# EAGLE design DataBoard (EAGLE 9.6.2)
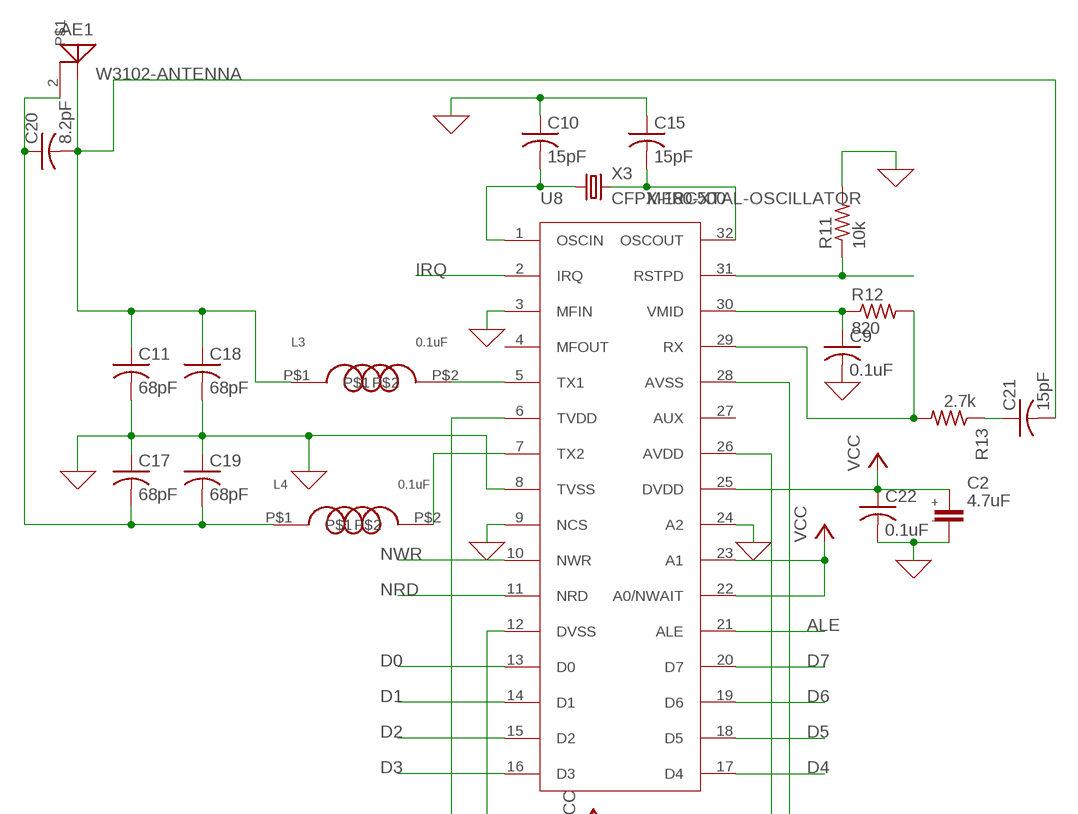
[diagram p0: schematic, sheet 1, part 1 of 2]
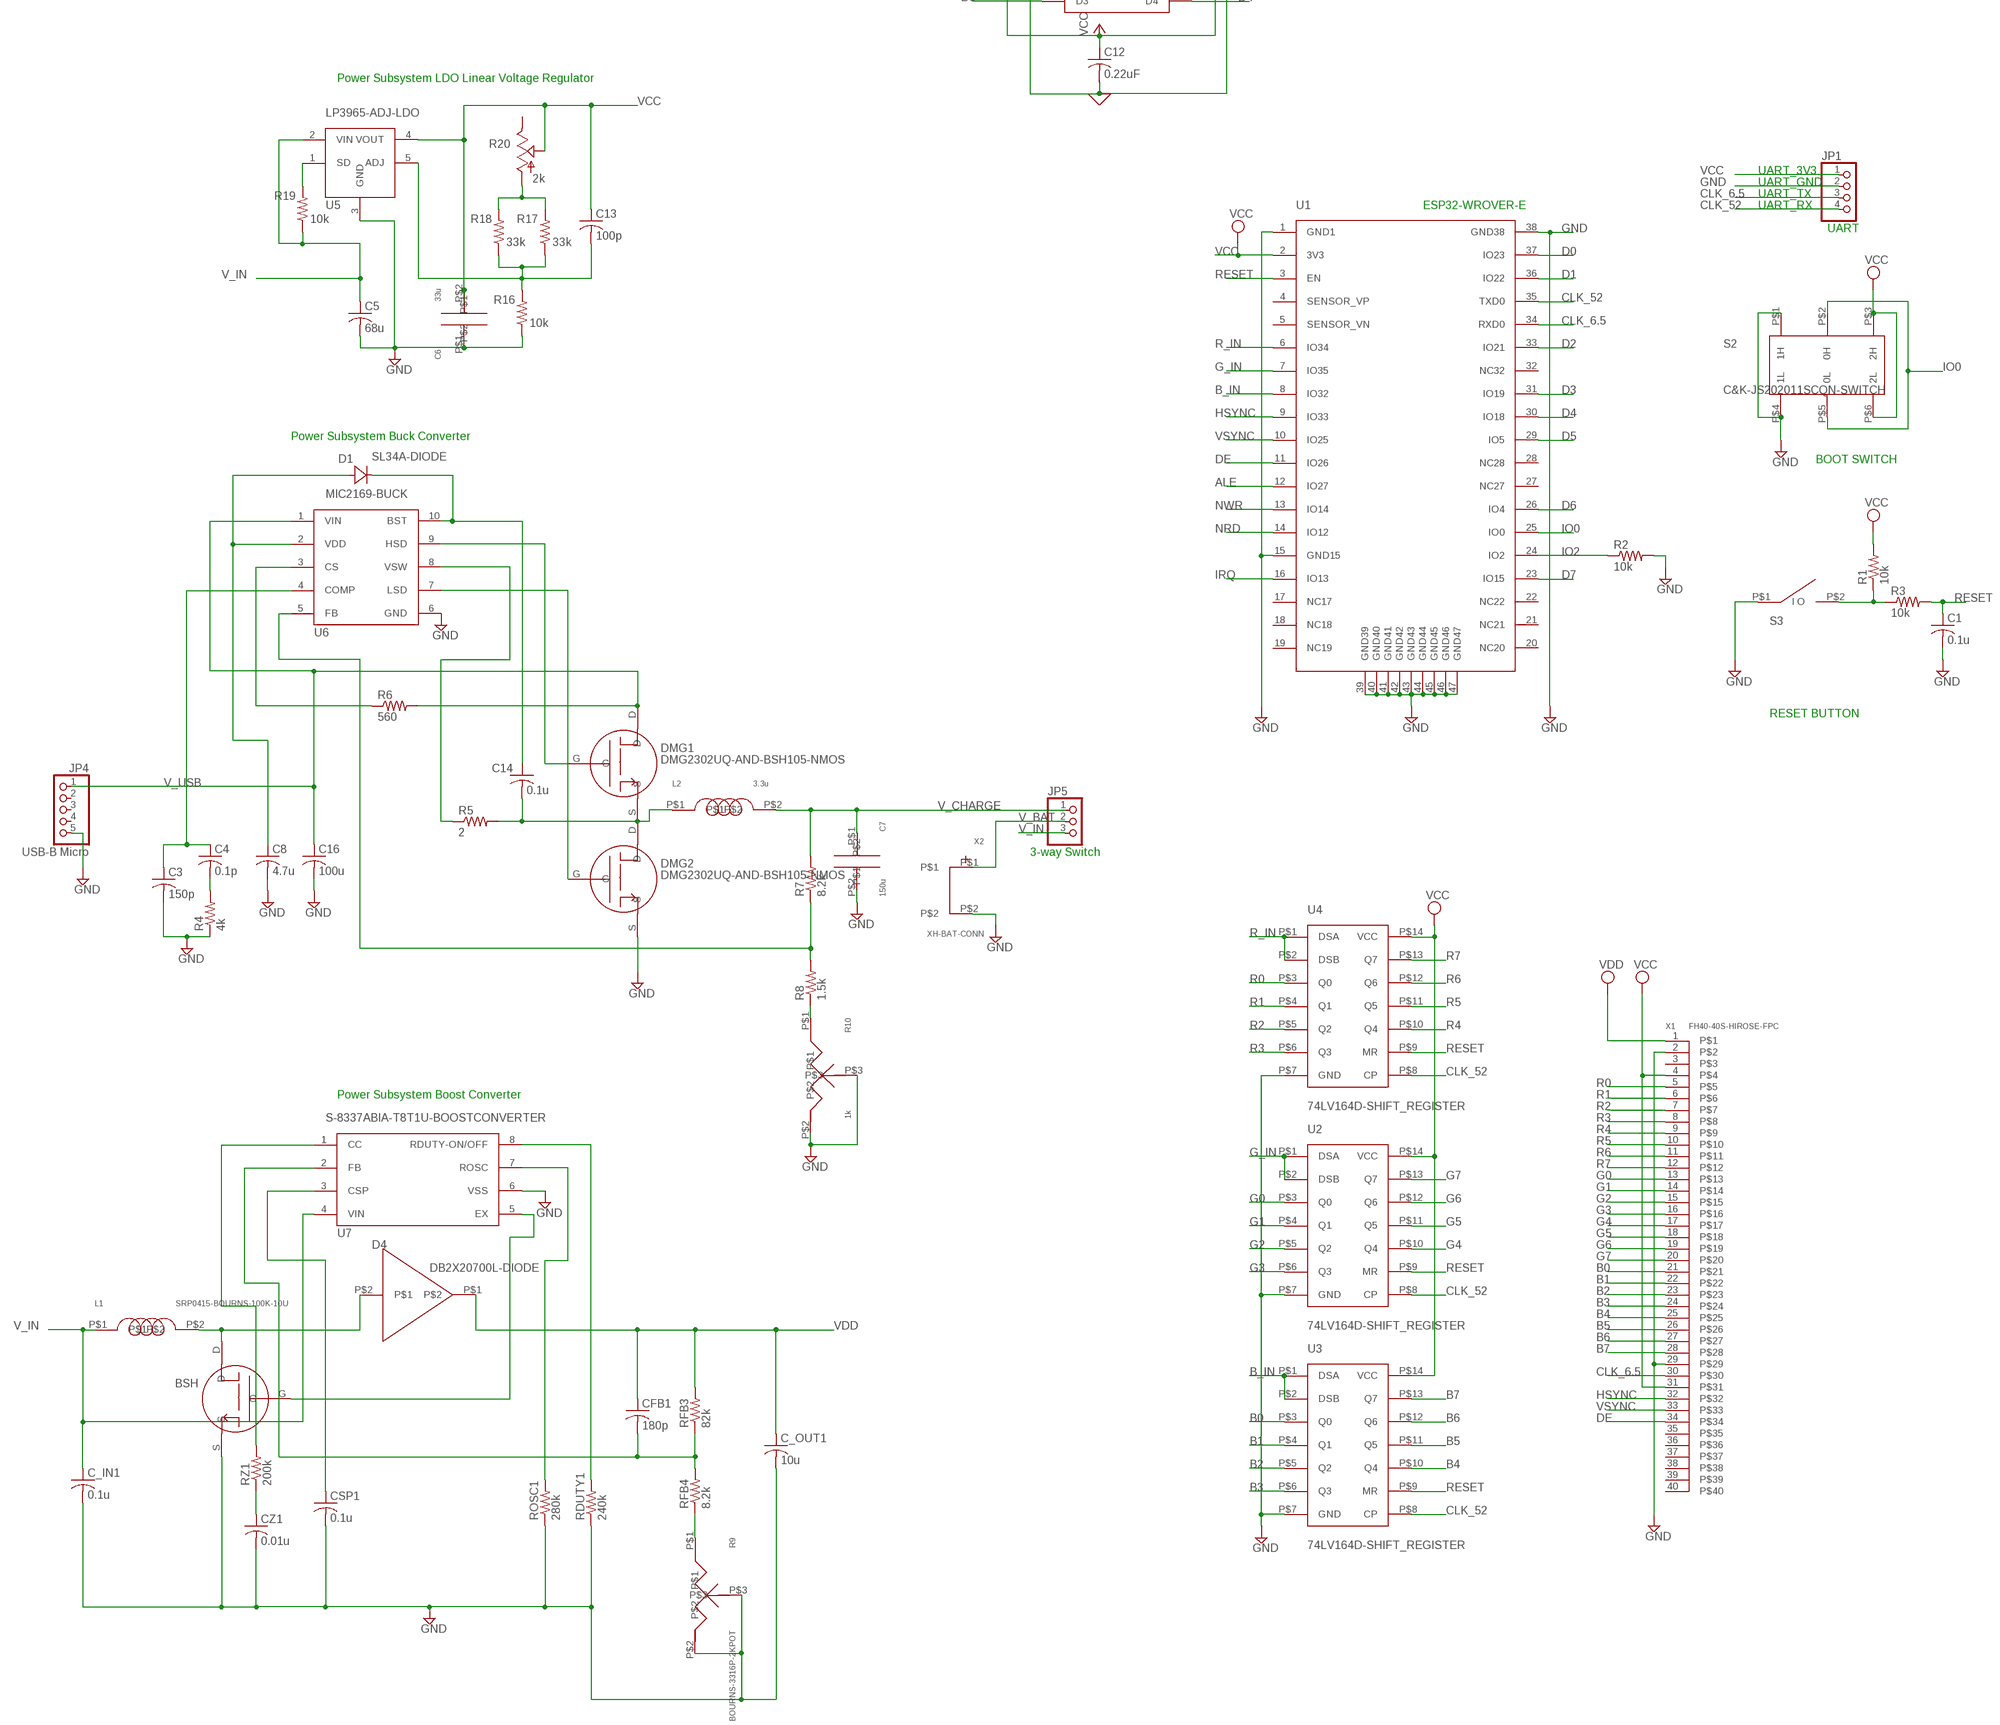
[diagram p1: schematic, sheet 1, part 2 of 2]

## Parts
AE1  W3102-ANTENNA  [W3102-ANTENNA]
BSH  DMG2302UQ-AND-BSH105-NMOS  [DMG2302UQ-AND-BSH105-NMOS]
C1  0.1u  C-USC0805  [C0805]
C2  4.7uF  865080640004-ELECTROLYTIC-CAP  [865080640004-ELECTROLYTIC-CAP]
C3  150p  C-USC0805  [C0805]
C4  0.1p  C-USC0603  [C0603]
C5  68u  C-USC1206  [C1206]
C6  33u  NEMCO-33U-TANT-CAP  [NEMCO-33U-TANT-CAP]
C7  150u  KEMET-T491-150U-TANT  [KEMET-T491-150U-TANT]
C8  4.7u  C-USC0603  [C0603]
C9  0.1uF  C-USC0805  [C0805]
C10  15pF  C-USC0805K  [C0805K]
C11  68pF  C-USC0805K  [C0805K]
C12  0.22uF  C-USC0402  [C0402]
C13  100p  C-USC0805  [C0805]
C14  0.1u  C-USC0805  [C0805]
C15  15pF  C-USC0805K  [C0805K]
C16  100u  C-USC1210  [C1210]
C17  68pF  C-USC0805K  [C0805K]
C18  68pF  C-USC0805K  [C0805K]
C19  68pF  C-USC0805K  [C0805K]
C20  8.2pF  C-USC0402  [C0402]
C21  15pF  C-USC0805K  [C0805K]
C22  0.1uF  C-USC0805  [C0805]
C_IN1  0.1u  C-USC0805  [C0805]
C_OUT1  10u  C-USC0805  [C0805]
CFB1  180p  C-USC0805  [C0805]
CSP1  0.1u  C-USC0805  [C0805]
CZ1  0.01u  C-USC0805  [C0805]
D1  SL34A-DIODE  [SL34A-DIODE]
D4  DB2X20700L-DIODE  [DB2X20700L-DIODE]
DMG1  DMG2302UQ-AND-BSH105-NMOS  [DMG2302UQ-AND-BSH105-NMOS]
DMG2  DMG2302UQ-AND-BSH105-NMOS  [DMG2302UQ-AND-BSH105-NMOS]
JP1  PINHD-1X4  [1X04]
JP4  USB-B Micro  PINHD-1X5  [1X05]
JP5  PINHD-1X3  [1X03]
L1  SRP0415-BOURNS-100K-10U  [SRP0415-BOURNS-100K-10U]
L2  3.3u  SRP0415-BOURNS-100K-10U  [SRP0415-BOURNS-100K-10U]
L3  0.1uF  SRP0415-BOURNS-100K-10U  [SRP0415-BOURNS-100K-10U]
L4  0.1uF  SRP0415-BOURNS-100K-10U  [SRP0415-BOURNS-100K-10U]
R1  10k  R-US_R0805  [R0805]
R2  10k  R-US_R0805  [R0805]
R3  10k  R-US_R0805  [R0805]
R4  4k  R-US_R0805  [R0805]
R5  2  R-US_R0805  [R0805]
R6  560  R-US_R0805  [R0805]
R7  8.2k  R-US_R0805  [R0805]
R8  1.5k  R-US_R0805  [R0805]
R9  BOURNS-3316P-2KPOT  [BOURNS-3316P-2KPOT]
R10  1k  BOURNS-3316P-2KPOT  [BOURNS-3316P-2KPOT]
R11  10k  R-US_R0805  [R0805]
R12  820  R-US_R0805  [R0805]
R13  2.7k  R-US_R0805  [R0805]
R16  10k  R-US_R0805  [R0805]
R17  33k  R-US_R0805  [R0805]
R18  33k  R-US_R0805  [R0805]
R19  10k  R-US_R0805  [R0805]
R20  2k  TRIM_US-3223G  [3223G]
RDUTY1  240k  R-US_R0805  [R0805]
RFB3  82k  R-US_R0805  [R0805]
RFB4  8.2k  R-US_R0805  [R0805]
ROSC1  280k  R-US_R0805  [R0805]
RZ1  200k  R-US_R0805  [R0805]
S2  C&K-JS202011SCQN-SWITCH  [C&K-JS202011SCQN-SWITCH]
S3  C&K-PTS636SL43SMTRLFS-PUSHBUTTON  [C&K-PTS636SL43SMTRLFS-PUSHBUTTON]
U1  ESP32-WROVER-E  [ESP32-WROVER-E]
U2  74LV164D-SHIFT_REGISTER  [74LV164D-SHIFT_REGISTER]
U3  74LV164D-SHIFT_REGISTER  [74LV164D-SHIFT_REGISTER]
U4  74LV164D-SHIFT_REGISTER  [74LV164D-SHIFT_REGISTER]
U5  LP3965-ADJ-LDO  [LP3965-ADJ-LDO]
U6  MIC2169-BUCK  [MIC2169-BUCK]
U7  S-8337ABIA-T8T1U-BOOSTCONVERTER  [S-8337ABIA-T8T1U-BOOSTCONVERTER]
U8  MFRC500  [MFRC500]
X1  FH40-40S-HIROSE-FPC  [FH40-40S-HIROSE-FPC]
X2  XH-BAT-CONN  [XH-BAT-CONN]
X3  CFPX-180-XTAL-OSCILLATOR  [CFPX-180-XTAL-OSCILLATOR]

## Nets
0: C2.2- C9.2 C10.1 C11.2 C12.2 C15.1 C17.1 C18.2 C19.1 C22.2 R11.2 U8.3(MFIN) U8.8(TVSS) U8.9(NCS) U8.12(DVSS) U8.24(A2) U8.28(AVSS) ; supply symbol labelled GND
ALE: U1.12(IO27) U8.21(ALE)
B0: U3.P$3(Q0) X1.21
B1: U3.P$4(Q1) X1.22
B2: U3.P$5(Q2) X1.23
B3: U3.P$6(Q3) X1.24
B4: U3.P$10(Q4) X1.25
B5: U3.P$11(Q5) X1.26
B6: U3.P$12(Q6) X1.27
B7: U3.P$13(Q7) X1.28
B_IN: U1.8(IO32) U3.P$1(DSA) U3.P$2(DSB)
CLK_6.5: JP1.3 U1.34(RXD0) X1.30
CLK_52: JP1.4 U1.35(TXD0) U2.P$8(CP) U3.P$8(CP) U4.P$8(CP)
D0: U1.37(IO23) U8.13(D0)
D1: U1.36(IO22) U8.14(D1)
D2: U1.33(IO21) U8.15(D2)
D3: U1.31(IO19) U8.16(D3)
D4: U1.30(IO18) U8.17(D4)
D5: U1.29(IO5) U8.18(D5)
D6: U1.26(IO4) U8.19(D6)
D7: U1.23(IO15) U8.20(D7)
DE: U1.11(IO26) X1.34
EN: R1.1 R3.1 S3.P$2(O)
G0: U2.P$3(Q0) X1.13
G1: U2.P$4(Q1) X1.14
G2: U2.P$5(Q2) X1.15
G3: U2.P$6(Q3) X1.16
G4: U2.P$10(Q4) X1.17
G5: U2.P$11(Q5) X1.18
G6: U2.P$12(Q6) X1.19
G7: U2.P$13(Q7) X1.20
G_IN: U1.7(IO35) U2.P$1(DSA) U2.P$2(DSB)
GND: BSH.S C1.2 C3.2 C5.2 C6.P$1 C7.P$2 C8.2 C16.2 C_IN1.2 C_OUT1.2 CSP1.2 CZ1.2 DMG2.S JP1.2 JP4.5 R2.2 R4.1 R9.P$2 R9.P$3 R10.P$2 R10.P$3 R16.1 RDUTY1.1 ROSC1.1 S2.P$1(1H) S2.P$4(1L) S3.P$1(I) U1.1(GND1) U1.15(GND15) U1.38(GND38) U1.39(GND39) U1.40(GND40) U1.41(GND41) U1.42(GND42) U1.43(GND43) U1.44(GND44) U1.45(GND45) U1.46(GND46) U1.47(GND47) U2.P$7(GND) U3.P$7(GND) U4.P$7(GND) U5.3(GND) U6.6(GND) U7.6(VSS) X1.2 X1.29 X2.P$2
HSYNC: U1.9(IO33) X1.32
IO0: S2.P$2(0H) S2.P$5(0L) U1.25(IO0)
IO2: R2.1 U1.24(IO2)
IRQ: U1.16(IO13) U8.2(IRQ)
N$1: C14.2 DMG1.S DMG2.D L2.P$1 R5.2
N$2: C8.1 D1.1(A) U6.2(VDD)
N$3: R5.1 U6.8(VSW)
N$4: C14.1 D1.2(C) U6.10(BST)
N$5: C10.2 U8.1(OSCIN) X3.1
N$6: C15.2 U8.32(OSCOUT) X3.3
N$7: R11.1 U8.31(RSTPD)
N$8: C9.1 R12.1 U8.30(VMID)
N$9: R12.2 R13.2 U8.29(RX)
N$10: C21.1 R13.1
N$11: L3.P$2 U8.5(TX1)
N$12: L4.P$2 U8.7(TX2)
N$13: AE1.1 C11.1 C18.1 C20.2 C21.2 L3.P$1
N$14: AE1.2 C17.2 C19.2 C20.1 L4.P$1
N$18: C13.2 R16.2 R17.1 R18.1 U5.5(ADJ)
N$25: R19.2 U5.1(SD)
N$26: R17.2 R18.2 R20.1(A)
N$27: DMG1.G U6.9(HSD)
N$28: DMG2.G U6.7(LSD)
N$29: R6.1 U6.3(CS)
N$30: C4.2 R4.2
N$31: C3.1 C4.1 U6.4(COMP)
N$33: R7.1 R8.2 U6.5(FB)
N$34: R8.1 R10.P$1
N$35: CSP1.1 U7.3(CSP)
N$36: BSH.G U7.5(EX)
N$37: CZ1.1 RZ1.1
N$38: RZ1.2 U7.1(CC)
N$39: CFB1.2 RFB3.1 RFB4.2 U7.2(FB)
N$40: ROSC1.2 U7.7(ROSC)
N$41: RDUTY1.2 U7.8(RDUTY-ON/OFF)
N$42: R9.P$1 RFB4.1
N$43: BSH.D D4.P$2 L1.P$2
NRD: U1.14(IO12) U8.11(NRD)
NWR: U1.13(IO14) U8.10(NWR)
R0: U4.P$3(Q0) X1.5
R1: U4.P$4(Q1) X1.6
R2: U4.P$5(Q2) X1.7
R3: U4.P$6(Q3) X1.8
R4: U4.P$10(Q4) X1.9
R5: U4.P$11(Q5) X1.10
R6: U4.P$12(Q6) X1.11
R7: U4.P$13(Q7) X1.12
R_IN: U1.6(IO34) U4.P$1(DSA) U4.P$2(DSB)
RESET: C1.1 R3.2 U1.3(EN) U2.P$9(MR) U3.P$9(MR) U4.P$9(MR)
V_BAT: JP5.2 X2.P$1
V_CHARGE: C7.P$1 JP5.1 L2.P$2 R7.2
V_IN: C5.1 C_IN1.1 JP5.3 L1.P$1 R19.1 U5.2(VIN) U7.4(VIN)
V_USB: C16.1 DMG1.D JP4.1 R6.2 U6.1(VIN)
VCC: C2.1+ C6.P$2 C12.1 C13.1 C22.1 JP1.1 R1.2 R20.2(S) S2.P$3(2H) S2.P$6(2L) U1.2(3V3) U2.P$14(VCC) U3.P$14(VCC) U4.P$14(VCC) U5.4(VOUT) U8.6(TVDD) U8.22(A0/NWAIT) U8.23(A1) U8.25(DVDD) U8.26(AVDD) X1.4 X1.31
VDD: C_OUT1.1 CFB1.1 D4.P$1 RFB3.2 X1.1
VSYNC: U1.10(IO25) X1.33
Unconnected: JP4.2 JP4.3 JP4.4 R20.3(E) U1.4(SENSOR_VP) U1.5(SENSOR_VN) U1.17(NC17) U1.18(NC18) U1.19(NC19) U1.20(NC20) U1.21(NC21) U1.22(NC22) U1.27(NC27) U1.28(NC28) U1.32(NC32) U8.4(MFOUT) U8.27(AUX) X1.3 X1.35 X1.36 X1.37 X1.38 X1.39 X1.40

## Notes on the sheet
- Power Subsystem LDO Linear Voltage Regulator
- UART_3V3
- UART_GND
- UART_TX
- ESP32-WROVER-E | UART_RX
- UART
- Power Subsystem Buck Converter
- BOOT SWITCH
- RESET BUTTON
- 3-way Switch
- Power Subsystem Boost Converter

## Library data of the parts
AE1 = OddsBooster_3_8_6PM:W3102-ANTENNA
BSH DMG1 DMG2 = OddsBooster:DMG2302UQ-AND-BSH105-NMOS
C1 C3-C5 C8-C22 C_IN1 C_OUT1 CFB1 CSP1 CZ1 = rcl:C-US: CAPACITOR, American symbol; SPICEPREFIX: C
C2 = OddsBooster:865080640004-ELECTROLYTIC-CAP
C6 = OddsBooster:NEMCO-33U-TANT-CAP
C7 = OddsBooster:KEMET-T491-150U-TANT
D1 = OddsBooster:SL34A-DIODE
D4 = OddsBooster:DB2X20700L-DIODE
JP1 = pinhead:PINHD-1X4: PIN HEADER
JP4 = pinhead:PINHD-1X5: PIN HEADER
JP5 = pinhead:PINHD-1X3: PIN HEADER
L1 L2 = OddsBooster:SRP0415-BOURNS-100K-10U
L3 L4 = OddsBooster_3_8_6PM:SRP0415-BOURNS-100K-10U
R1-R8 R11-R13 R16-R19 RDUTY1 RFB3 RFB4 ROSC1 RZ1 = rcl:R-US_: RESISTOR, American symbol; SPICEPREFIX: R
R9 R10 = OddsBooster:BOURNS-3316P-2KPOT
R20 = pot:TRIM_US-: POTENTIOMETER
S2 = OddsBooster:C&K-JS202011SCQN-SWITCH
S3 = OddsBooster:C&K-PTS636SL43SMTRLFS-PUSHBUTTON
U1 = OddsBooster:ESP32-WROVER-E: ESP32-WROVER-E Module used for Bluetooth and Wifi commmunications. Includes Transceiver IC, MCU, Antenna, and Xtal Oscillators.
U2-U4 = OddsBooster:74LV164D-SHIFT_REGISTER
U5 = OddsBooster:LP3965-ADJ-LDO
U6 = OddsBooster:MIC2169-BUCK
U7 = OddsBooster:S-8337ABIA-T8T1U-BOOSTCONVERTER
U8 = OddsBooster_3_8_6PM:MFRC500
X1 = OddsBooster:FH40-40S-HIROSE-FPC
X2 = OddsBooster:XH-BAT-CONN
X3 = OddsBooster:CFPX-180-XTAL-OSCILLATOR

## Board
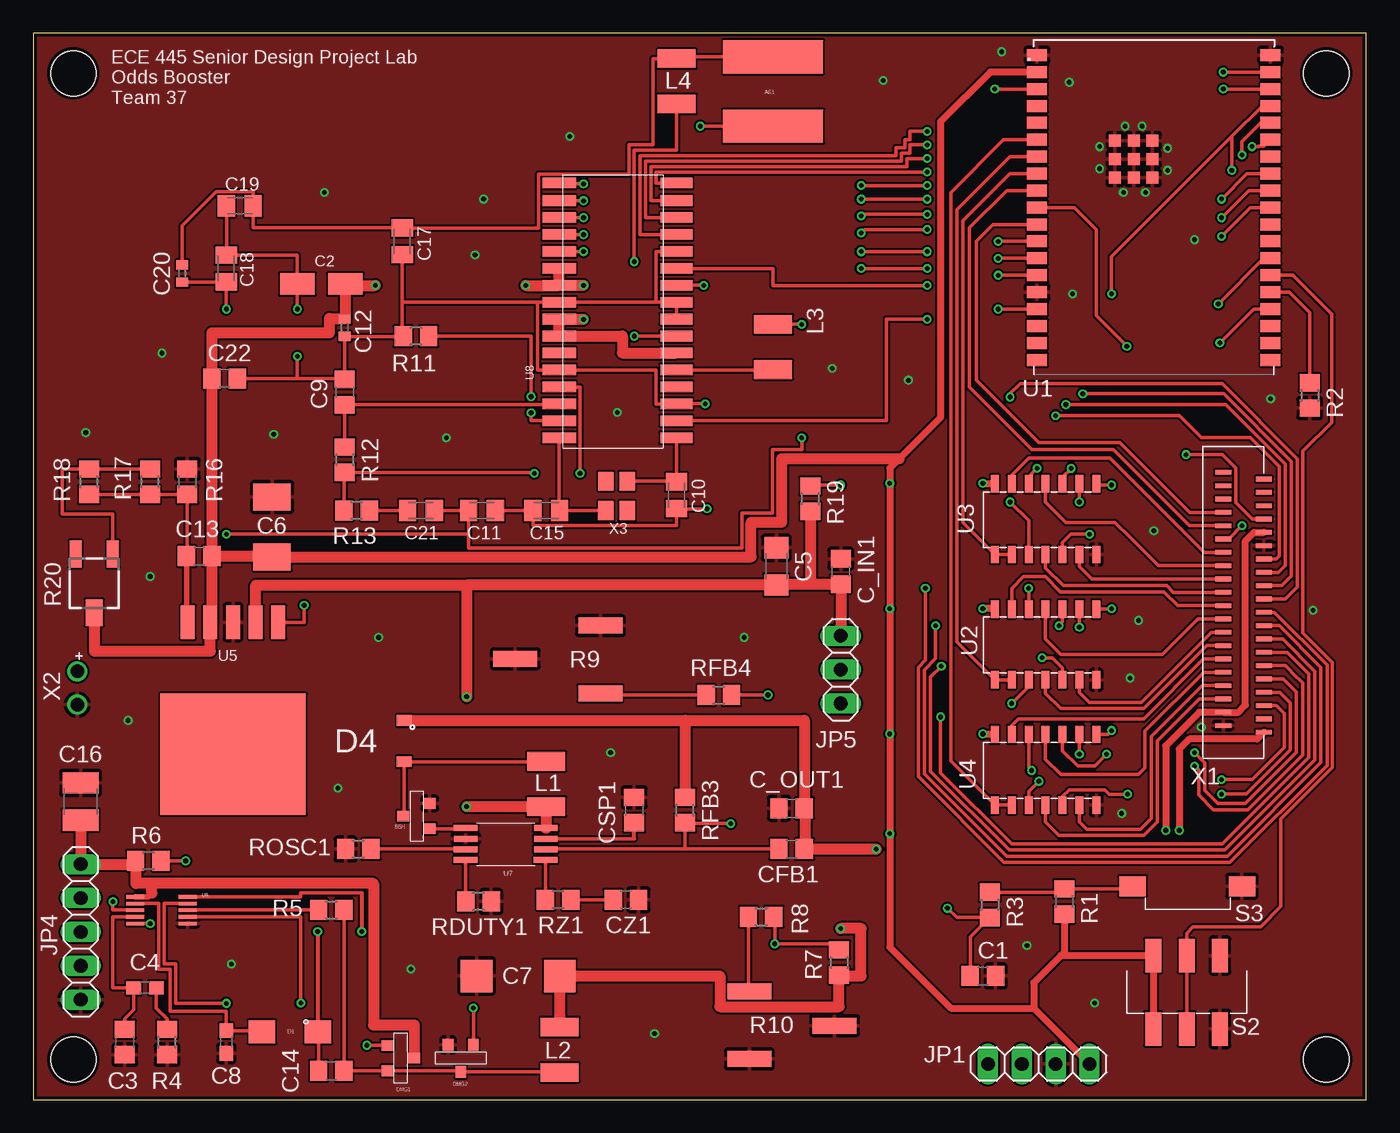
[diagram p2: board, top side]
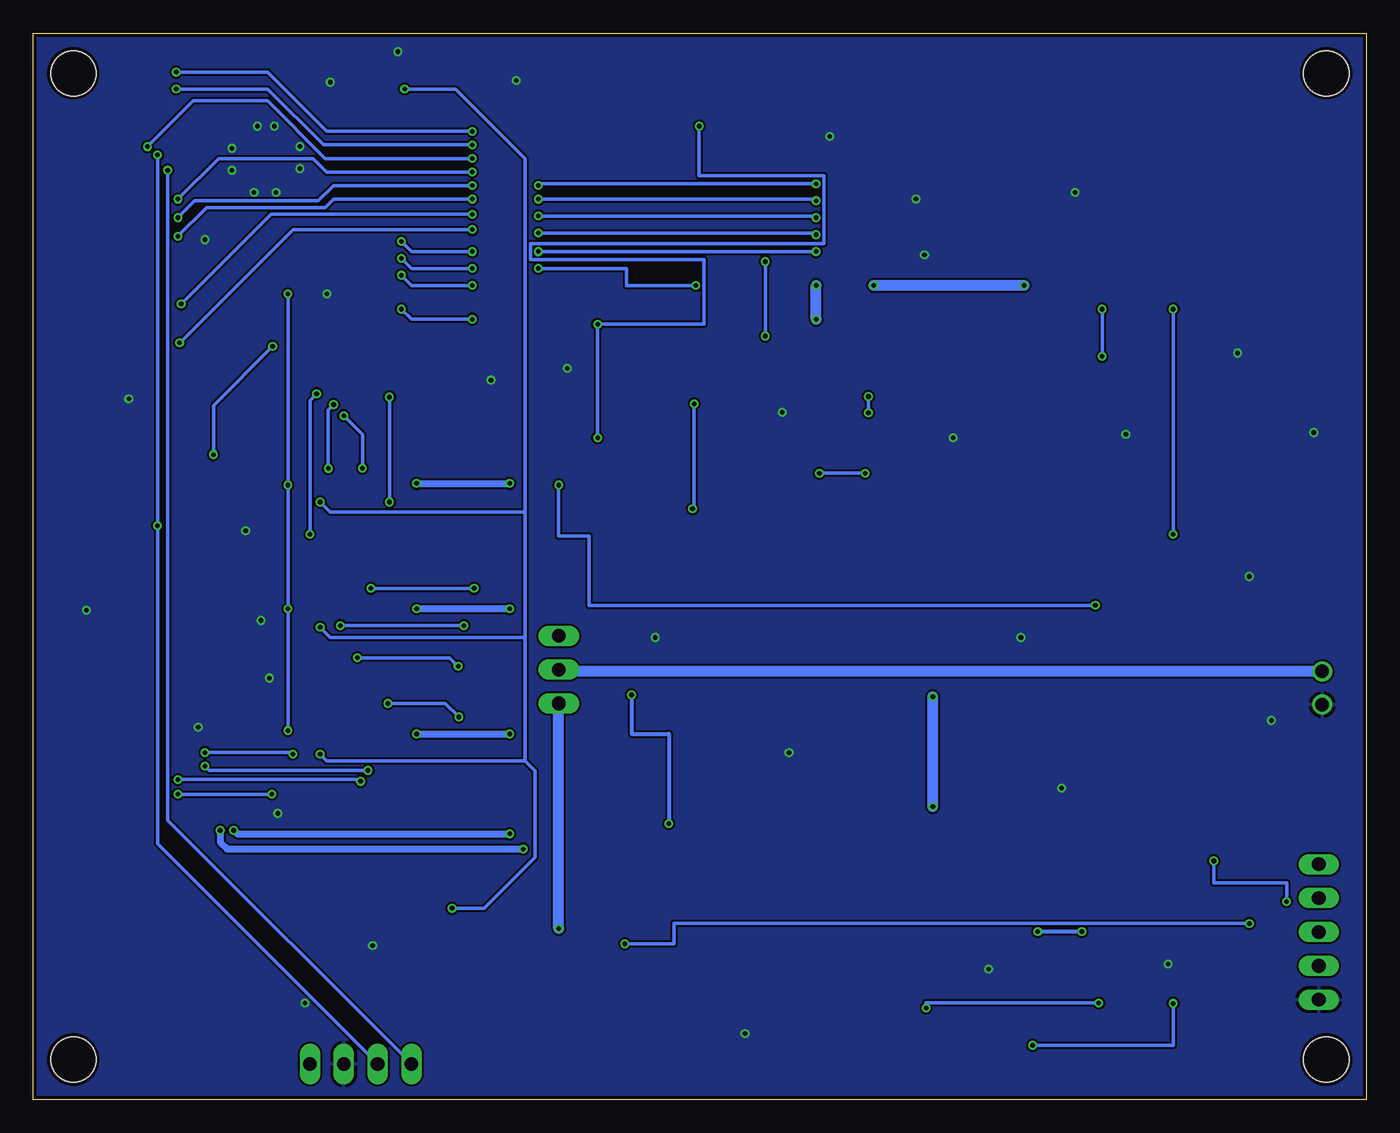
[diagram p3: board, bottom side, seen from below]

Size 100 x 80 mm. Coordinates in mm from the lower left corner, seen from the top.
Outline: 0,0 100,0 100,80 0,80 0,0
Copper layers (1*16): Top 0.035mm / dielectric 1.5mm / Bottom 0.035mm
Design rules "PCBWay_2layer": minimum track width 6mil, minimum drill 0.3mm, track to track 6mil, track to pad 6mil, pad to pad 6mil, via to via 6mil, smd to smd 4mil, copper to edge 10mil, drill to drill 6mil, minimum pad ring 6mil, minimum via ring 6mil, stop-mask expansion 4mil, vias tented up to drill 0.8mm, thermal gap 10mil
Holes 3.4 mm at 97,77 97,3 3,77 3,3

### Footprints (pad centres in the part's own frame; a part is rotated, then mirrored left to right if it is on the bottom)
W3102-ANTENNA = smd 2.5 x 7.5: 1 0,0; 2 5.2,0
DMG2302UQ-AND-BSH105-NMOS = smd 0.8 x 0.9: D 0,0; G -0.95,-2; S 0.95,-2
C0805 = smd 1.3 x 1.5: 1 -0.95,0; 2 0.95,0
865080640004-ELECTROLYTIC-CAP = smd 2.6 x 1.6: 1+ 0,0; 2- 3.6,0
C0603 = smd 1.1 x 1: 1 -0.85,0; 2 0.85,0
C1206 = smd 1.6 x 1.8: 1 -1.4,0; 2 1.4,0
NEMCO-33U-TANT-CAP = smd 2 x 2.8: P$1 0,0; P$2 4.5,0
KEMET-T491-150U-TANT = smd 2.37 x 2.43: P$1 0,0; P$2 6.24,0
C0805K = smd 1.3 x 1.6: 1 -1,0; 2 1,0
C0402 = smd 0.7 x 0.9: 1 -0.65,0; 2 0.65,0
C1210 = smd 1.6 x 2.7: 1 -1.4,0; 2 1.4,0
SL34A-DIODE = smd 2 x 1.72: 1 0,0; 2 4.2,0
DB2X20700L-DIODE = smd 1.1 x 0.8: P$1 0,0; P$2 0,3.1
1X04 = drill 1.016 long: 1 -3.81,0; 2 -1.27,0; 3 1.27,0; 4 3.81,0
1X05 = drill 1.016 long: 1 -5.08,0; 2 -2.54,0; 3 0,0; 4 2.54,0; 5 5.08,0
1X03 = drill 1.016 long: 1 -2.54,0; 2 0,0; 3 2.54,0
SRP0415-BOURNS-100K-10U = smd 1.4 x 2.85: P$1 0,0; P$2 3.4,0
R0805 = smd 1.3 x 1.5: 1 -0.95,0; 2 0.95,0
BOURNS-3316P-2KPOT = smd 1.19 x 3.3: P$1 0,0; P$2 5.08,0; P$3 2.59,6.4
3223G = smd 2 x 0.9: 1 -2.2,1.4; 3 -2.2,-1.4 | smd 2 x 1.3: 2 2.2,0
C&K-JS202011SCQN-SWITCH = smd 1.2 x 2.5: P$1 0,5.5; P$2 2.5,5.5; P$3 5,5.5; P$4 0,0; P$5 2.5,0; P$6 5,0
C&K-PTS636SL43SMTRLFS-PUSHBUTTON = smd 2 x 1.5: P$1 0,0; P$2 8.2,0
ESP32-WROVER-E = smd 1.5 x 0.9: 1 0,0; 2 0,-1.27; 3 0,-2.54; 4 0,-3.81; 5 0,-5.08; 6 0,-6.35; 7 0,-7.62; 8 0,-8.89; 9 0,-10.16; 10 0,-11.43; 11 0,-12.7; 12 0,-13.97; 13 0,-15.24; 14 0,-16.51; 15 0,-17.78; 16 0,-19.05; 17 0,-20.32; 18 0,-21.59; 19 0,-22.86; 20 17.5,-22.86; 21 17.5,-21.59; 22 17.5,-20.32; 23 17.5,-19.05; 24 17.5,-17.78; 25 17.5,-16.51; 26 17.5,-15.24; 27 17.5,-13.97; 28 17.5,-12.7; 29 17.5,-11.43; 30 17.5,-10.16; 31 17.5,-8.89; 32 17.5,-7.62; 33 17.5,-6.35; 34 17.5,-5.08; 35 17.5,-3.81; 36 17.5,-2.54; 37 17.5,-1.27; 38 17.5,0 | smd 0.9 x 0.9: 39 7.25,-7.8; 40 5.85,-6.4; 41 7.25,-6.4; 42 8.65,-6.4; 43 5.85,-7.8; 44 8.65,-7.8; 45 5.85,-9.2; 46 7.25,-9.2; 47 8.65,-9.2
74LV164D-SHIFT_REGISTER = smd 1.3 x 0.6: P$1 0,0; P$2 0,-1.27; P$3 0,-2.54; P$4 0,-3.81; P$5 0,-5.08; P$6 0,-6.35; P$7 0,-7.62; P$8 5.3,-7.62; P$9 5.3,-6.35; P$10 5.3,-5.08; P$11 5.3,-3.81; P$12 5.3,-2.54; P$13 5.3,-1.27; P$14 5.3,0
LP3965-ADJ-LDO = smd 1.05 x 2.5: 1 -3.4,-9.9; 2 -1.7,-9.9; 3 0,-9.9; 4 1.7,-9.9; 5 3.4,-9.9 | smd 10.9 x 9.1: HEAT 0,0
MIC2169-BUCK = smd 0.27 x 1.35: 1 -0.96,-2.11; 2 -0.46,-2.11; 3 0.04,-2.11; 4 0.54,-2.11; 5 1.04,-2.11; 6 1.04,1.83; 7 0.54,1.83; 8 0.04,1.83; 9 -0.46,1.83; 10 -0.96,1.83
S-8337ABIA-T8T1U-BOOSTCONVERTER = smd 1.78 x 0.45: 1 -2.11,-0.19; 2 -2.12,-0.99; 3 -2.13,-1.79; 4 -2.12,-2.59; 5 3.89,-2.59; 6 3.88,-1.79; 7 3.89,-0.99; 8 3.89,-0.19
MFRC500 = smd 0.8 x 2.4: 1 0.75,-8.5; 2 2.04,-8.5; 3 3.31,-8.5; 4 4.58,-8.5; 5 5.85,-8.5; 6 7.12,-8.5; 7 8.39,-8.5; 8 9.66,-8.5; 9 10.93,-8.5; 10 12.2,-8.5; 11 13.47,-8.5; 12 14.74,-8.5; 13 16.01,-8.5; 14 17.28,-8.5; 15 18.55,-8.5; 16 19.87,-8.5 | smd 0.8 x 2.5: 17 19.87,0.3; 18 18.55,0.3; 19 17.28,0.3; 20 16.01,0.3; 21 14.74,0.3; 22 13.47,0.3; 23 12.2,0.3; 24 10.93,0.3; 25 9.66,0.3; 26 8.39,0.3; 27 7.12,0.3; 28 5.85,0.3; 29 4.58,0.3; 30 3.31,0.3; 31 2.04,0.3; 32 0.75,0.3
FH40-40S-HIROSE-FPC = smd 1.2 x 0.35: 1 0,0; 2 3.05,-0.5; 3 0,-1; 4 3.05,-1.5; 5 0,-2; 6 3.05,-2.5; 7 0,-3; 8 3.05,-3.5; 9 0,-4; 10 3.05,-4.5; 11 0,-5; 12 3.05,-5.5; 13 0,-6; 14 3.05,-6.5; 15 0,-7; 16 3.05,-7.5; 17 0,-8; 18 3.05,-8.5; 19 0,-9; 20 3.05,-9.5; 21 0,-10; 22 3.05,-10.5; 23 0,-11; 24 3.05,-11.5; 25 0,-12; 26 3.05,-12.5; 27 0,-13; 28 3.05,-13.5; 29 0,-14; 30 3.05,-14.5; 31 0,-15; 32 3.05,-15.5; 33 0,-16; 34 3.05,-16.5; 35 0,-17; 36 3.05,-17.5; 37 0,-18; 38 3.05,-18.5; 39 0,-19; 40 3.05,-19.5
XH-BAT-CONN = drill 1: P$1 0,0; P$2 2.5,0
CFPX-180-XTAL-OSCILLATOR = smd 1.4 x 1.15: 1 0,0; 2 2.2,0; 3 2.2,-1.6; 4 0,-1.6

### Placement (x,y rotation side)
AE1  55.5,73.03 90 top
BSH  27.75,21.27 90 top
C1  71.25,9.27 0 top
C2  23.41,61.19 180 top
C3  6.86,4.32 270 top
C4  8.38,8.38 0 top
C5  55.75,40.01 90 top
C6  17.91,45.21 270 top
C7  39.5,9.27 180 top
C8  14.48,4.32 270 top
C9  23.37,53.09 90 top
C10  48.26,45.34 90 top
C11  33.66,44.2 0 top
C12  23.37,57.91 270 top
C13  12.45,40.77 180 top
C14  22.35,2.16 0 top
C15  38.48,44.2 0 top
C16  3.56,22.35 90 top
C17  27.69,64.39 90 top
C18  14.48,62.36 90 top
C19  15.49,67.06 0 top
C20  11.18,61.98 270 top
C21  29.08,44.2 0 top
C22  14.35,54.1 0 top
C_IN1  60.58,39.62 90 top
C_OUT1  56.9,21.84 180 top
CFB1  56.9,18.8 180 top
CSP1  45.09,21.72 90 top
CZ1  44.45,14.99 0 top
D1  17.14,5.08 0 top
D4  27.81,28.45 180 top
DMG1  28.58,3.11 270 top
DMG2  32.06,2.09 180 top
JP1  75.44,2.67 180 top
JP4  3.56,12.57 270 top
JP5  60.58,32.26 90 top
L1  38.48,21.97 90 top
L2  39.5,2.03 90 top
L3  55.5,58.17 270 top
L4  48.26,78.11 270 top
R1  77.34,14.86 270 top
R2  95.76,52.83 270 top
R3  71.75,14.61 270 top
R4  10.03,4.32 90 top
R5  22.35,14.22 0 top
R6  8.64,17.91 180 top
R7  60.45,10.29 270 top
R8  54.61,13.72 0 top
R9  42.55,30.48 90 top
R10  53.72,8.13 270 top
R11  28.7,57.28 180 top
R12  23.37,48.01 270 top
R13  24.26,44.2 180 top
R16  11.56,46.35 270 top
R17  8.76,46.35 90 top
R18  4.19,46.35 90 top
R19  58.29,45.09 90 top
R20  4.57,38.73 270 top
RDUTY1  33.4,14.86 180 top
RFB3  48.9,21.72 90 top
RFB4  51.44,30.35 0 top
ROSC1  24.38,18.8 0 top
RZ1  39.37,14.99 180 top
S2  89.03,10.79 180 top
S3  90.68,16 180 top
U1  75.31,78.36 0 top
U2  72.14,31.5 90 top
U3  72.14,40.89 90 top
U4  72.14,22.1 90 top
U5  14.99,25.91 180 top
U6  9.77,14.25 270 top
U7  36.32,17.78 180 top
U8  39.75,48.9 90 top
X1  92.33,27.56 180 top
X2  3.3,32.13 270 top
X3  44.55,46.4 270 top

### Tracks (layer width: path | path; a pad name or v marks a point on that pad's centre or on a via)
0  (via drill 0.35)
  Top 0.254: C11.2 C15.1 37.48,43.05 48.26,43.05 C10.1 48.26,44.32 v50.55,44.32 | C22.2 19.81,54.1 | 19.81,54.1 23.3,54.1 C9.2 C12.2 27.74,57.26 R11.2 27.69,57.34 27.69,59.82 | 46.74,59.83 U8.24 39.44,59.82 37.85,59.82 | 46.74,59.83 U8.9 U8.8 | 27.69,59.82 37.85,59.82 | C19.1 14.49,63.37 C18.2 19.81,63.36 C2.2- v19.81,59.31 | 37.85,59.82 37.85,54.74 U8.28 46.74,54.74 46.74,52.2 48.25,52.2 U8.3 v50.42,52.2 | 46.74,59.83 46.74,63.63 U8.12 | v19.81,55.75 19.81,54.1 | C17.1 27.69,59.82
  Bottom 0.254: v19.81,59.31 v19.81,55.75 | v50.42,52.2 50.42,44.32 v50.55,44.32
ALE  (via drill 0.35)
  Top 0.254: U1.12 v72.39,64.39 | v67.06,63.63 64.26,63.63 64.01,63.63 v62.1,63.63 | U8.21 39.46,63.63 v41.27,63.63
  Bottom 0.254: v72.39,64.39 71.63,63.63 v67.06,63.63 | v41.27,63.63 v62.1,63.63
B0  (via drill 0.35)
  Top 0.254: X1.21 93.95,37.56 94.85,38.46 94.85,48.07 89.2,53.72 74.04,53.72 73.28,52.96 v73.28,52.7 | v73.28,44.83 74.68,43.43 U3.P$3
  Bottom 0.254: v73.28,52.7 v73.28,44.83
B1
  Top 0.254: X1.22 85.53,38.06 85.03,38.56 77.27,38.56 75.95,39.88 U3.P$4
B2  (via drill 0.35)
  Top 0.254: X1.23 93.68,38.56 94.39,39.27 94.39,47.88 89.31,52.96 v78.74,52.96 | v79.25,42.42 77.85,42.42 77.22,41.78 U3.P$5
  Bottom 0.254: v78.74,52.96 79.25,52.45 v79.25,42.42
B3
  Top 0.254: X1.24 79.43,39.06 78.49,40.01 U3.P$6
B4  (via drill 0.35)
  Top 0.254: X1.25 93.41,39.56 93.93,40.08 93.93,47.69 89.47,52.15 v77.47,52.15 | U3.P$10 77.22,46.7 v77.87,47.35
  Bottom 0.254: v77.87,47.35 77.87,51.75 v77.47,52.15
B5
  Top 0.254: X1.26 84.4,40.06 82.3,42.16 81.15,43.31 77.47,43.31 75.95,44.83 U3.P$11
B6  (via drill 0.35)
  Top 0.254: X1.27 93.26,40.56 93.47,40.77 93.47,47.5 91.31,49.66 87.63,49.66 85.98,51.31 v76.71,51.31 | U3.P$12 74.68,46.74 v75.31,47.37
  Bottom 0.254: v76.71,51.31 75.31,49.91 v75.31,47.37
B7
  Top 0.254: X1.28 87.85,41.06 80.77,48.13 74.68,48.13 73.41,46.86 U3.P$13
B_IN
  Top 0.254: U1.8 73.28,69.47 69.75,65.94 69.75,43.28 U3.P$1 U3.P$2
CLK_6.5  (via drill 0.35)
  Top 0.254: U1.34 92.08,73.28 90.68,71.88 v90.68,70.87 | X1.30 89.68,42.06 v90.68,43.05
  Bottom 0.254: JP1.3 90.68,19.18 v90.68,43.05 v90.68,70.87
CLK_52  (via drill 0.35)
  Top 0.254: v80.9,60.45 80.9,63.25 89.92,72.26 | U1.35 92.2,74.55 89.92,72.26 | 89.92,72.26 v89.92,69.72 | v80.9,27.69 80.61,27.4 U4.P$8 | v80.9,36.83 80.86,36.8 U2.P$8 | v80.9,46.1 79.85,46.1 U3.P$8
  Bottom 0.254: v80.9,27.69 v80.9,36.83 v80.9,46.1 v80.9,60.45 | JP1.4 89.92,20.95 v89.92,69.72
D0  (via drill 0.35)
  Top 0.254: U1.37 v89.28,77.09 | v67.06,72.64 65.79,72.64 65.79,72.03 65.38,72.03 65.38,71.42 64.72,71.42 64.72,70.81 45.52,70.81 45.52,64.91 U8.13
  Bottom 0.254: v89.28,77.09 82.42,77.09 77.98,72.64 v67.06,72.64
D1  (via drill 0.35)
  Top 0.254: U1.36 v89.28,75.82 | U8.14 45.92,66.17 45.92,70.41 65.13,70.41 65.13,71.02 65.79,71.02 65.79,71.63 v67.06,71.63
  Bottom 0.254: v67.06,71.63 78.23,71.63 82.42,75.82 v89.28,75.82
D2  (via drill 0.35)
  Top 0.254: v67.06,70.61 65.53,70.61 65.53,70 46.33,70 46.33,67.44 U8.15 | U1.33 92.32,71.52 91.92,71.52 91.9,71.5 v91.44,71.5
  Bottom 0.254: v91.44,71.5 88.01,74.93 82.42,74.93 78.11,70.61 v67.06,70.61
D3  (via drill 0.35)
  Top 0.254: v89.15,67.56 91.06,69.47 U1.31 | v67.06,69.6 46.74,69.6 46.74,68.77 U8.16
  Bottom 0.254: v89.15,67.56 86.11,70.61 78.99,70.61 77.98,69.6 v67.06,69.6
D4  (via drill 0.35)
  Top 0.254: v67.06,68.58 v62.1,68.58 | v89.15,66.17 91.19,68.2 U1.30 | U8.17 39.51,68.71 v41.27,68.71
  Bottom 0.254: v89.15,66.17 87.88,67.44 78.61,67.44 77.47,68.58 v67.06,68.58 | v41.27,68.71 61.98,68.71 v62.1,68.58
D5  (via drill 0.35)
  Top 0.254: v67.06,67.56 64.26,67.56 64.01,67.56 v62.1,67.56 | v89.15,64.77 91.31,66.93 U1.29 | U8.18 v41.27,67.44
  Bottom 0.254: v89.15,64.77 87,66.93 78.11,66.93 77.47,67.56 v67.06,67.56 | v41.27,67.44 41.4,67.56 v62.1,67.56
D6  (via drill 0.35)
  Top 0.254: U1.26 92.33,63.12 v88.9,59.69 | v67.06,66.42 64.26,66.42 64.01,66.42 62.23,66.42 v62.1,66.29 | U8.19 39.46,66.17 v41.27,66.17
  Bottom 0.254: v88.9,59.69 82.17,66.42 v67.06,66.42 | v41.27,66.17 41.4,66.29 v62.1,66.29
D7  (via drill 0.35)
  Top 0.254: U1.23 91.57,59.31 v89.03,56.77 | U8.20 39.46,64.9 v41.27,64.9 | v62.1,65.02 62.36,65.28 v67.06,65.28
  Bottom 0.254: v67.06,65.28 80.52,65.28 v89.03,56.77 | v41.27,64.9 41.4,65.02 v62.1,65.02
DE
  Top 0.254: X1.34 86.75,44.06 81.53,49.28 75.44,49.28 70.74,53.98 70.74,64.39 72.01,65.66 U1.11
EN
  Top 0.152: 82.28,15.81 S3.P$2 | 77.09,15.55 R1.1
  Top 0.254: R1.1 82.28,15.81 | R3.1 77.09,15.55
G0  (via drill 0.35)
  Top 0.254: X1.13 94.08,33.56 95.69,31.95 95.69,25.66 89.21,19.18 73.41,19.18 68.07,24.51 v68.07,28.7 | v73.41,29.72 74.68,30.99 U2.P$3
  Bottom 0.254: v68.07,28.7 69.09,29.72 v73.41,29.72
G1
  Top 0.254: X1.14 88.03,34.06 83.31,29.34 77.09,29.34 75.95,30.48 U2.P$4
G2  (via drill 0.35)
  Top 0.254: v68.12,32.51 67.31,31.7 67.31,24.62 73.22,18.72 89.4,18.72 96.15,25.46 96.15,32.14 93.72,34.56 X1.15 | v75.69,33.15 76.45,33.15 77.22,32.38 U2.P$5
  Bottom 0.254: v68.12,32.51 68.76,33.15 v75.69,33.15
G3
  Top 0.254: U2.P$6 78.49,30.56 79.25,29.8 83.12,29.8 88.39,35.06 X1.16
G4  (via drill 0.35)
  Top 0.254: X1.17 93.47,35.56 96.61,32.42 96.61,25.27 89.59,18.26 73.03,18.26 66.85,24.43 66.85,32.24 67.69,33.08 v67.69,35.56 | v76.96,35.56 77.22,35.81 U2.P$10
  Bottom 0.254: v67.69,35.56 v76.96,35.56
G5
  Top 0.254: X1.18 87.37,36.06 84.71,33.4 77.09,33.4 75.95,34.54 U2.P$11
G6  (via drill 0.35)
  Top 0.254: X1.19 93.12,36.56 97.07,32.62 97.07,25.09 89.78,17.8 72.84,17.8 66.39,24.24 66.39,32.43 66.93,32.97 v66.93,38.35 | v74.68,38.35 U2.P$12
  Bottom 0.254: v66.93,38.35 v74.68,38.35
G7
  Top 0.254: X1.20 85.88,37.06 84.84,38.1 77.08,38.1 75.93,39.24 74.3,39.24 73.41,38.35 U2.P$13
G_IN
  Top 0.254: U1.7 73.28,70.74 69.29,66.75 69.29,34.34 U2.P$1 U2.P$2
GND  (via drill 0.35)
  other vias: 87.63,27.94 82.3,31.62 92.84,52.58 84.07,42.67 82.93,35.94 96.01,36.7 81.66,21.46 79.63,7.24 74.55,11.56 72.64,78.61 53.34,34.67 43.31,26.04 25.91,34.67 22.86,23.37 7.11,28.45 28.32,9.78 14.86,10.16 46.61,4.95 65.66,53.98 77.98,60.45 87.12,64.52 77.72,76.33 80.01,69.85 81.79,68.07 83.44,68.07 85.09,69.72 85.09,71.37 83.19,73.03 80.01,71.5 81.92,73.03 18.03,49.91 30.99,49.66 63.75,76.45 59.94,54.86 33.15,63.37 43.81,51.56 40.26,72.26 21.84,68.07 9.65,56.01 33.78,67.56 8.76,39.24 3.94,50.04
  pour Top: 0,0 100,0 100,80 0,80
  pour Bottom: 0,0 100,0 100,80 0,80
HSYNC
  Top 0.254: X1.32 86.73,43.06 81.03,48.77 74.93,48.77 70.23,53.47 70.23,65.41 73.03,68.2 U1.9
IO0
  Top 0.254: S2.P$2 S2.P$5 86.53,12.49 87,12.95 92.08,12.95 93.6,14.48 93.6,21.04 97.47,24.92 97.47,32.78 95.25,35 95.25,48.65 97.41,50.8 97.41,58.93 94.49,61.85 U1.25
IO2
  Top 0.254: R2.1 95.76,59.05 94.23,60.58 U1.24
IRQ  (via drill 0.35)
  Top 0.254: U1.16 v72.39,59.31 | v67.06,58.55 64.01,58.55 64.01,50.93 64,50.94 U8.2
  Bottom 0.254: v72.39,59.31 71.63,58.55 v67.06,58.55
N$1
  Top 0.254: L2.P$1 39.44,2.09 DMG2.D 32,2.16 DMG1.S C14.2 R5.2
N$2
  Top 0.254: D1.1 17.06,5.17 C8.1 14.48,6.6 10.29,6.6 10.29,9.78 9.4,9.78 9.4,14.71 U6.2
N$3
  Top 0.254: U6.8 11.61,14.22 R5.1
N$4  (via drill 0.35)
  Top 0.254: C14.1 21.4,5.02 D1.2 | U6.10 20.07,15.21 20.07,15.49 24.64,15.49
  Top 0.305: 24.64,15.49 v24.64,12.6 | v21.34,12.6 21.34,5.02 21.4,5.02
  Bottom 0.305: v24.64,12.6 v21.34,12.6
N$5
  Top 0.254: U8.1 48.26,49.64 C10.2 48.2,46.4 X3.1
N$6
  Top 0.254: X3.3 39.5,44.2 | 39.5,44.2 C15.2 | U8.32 39.45,44.24 39.5,44.2
N$7  (via drill 0.35)
  Top 0.254: R11.1 37.34,57.28 v37.34,52.74 | v37.34,51.53 37.34,50.93 39.45,50.93 U8.31
  Bottom 0.254: v37.34,52.74 v37.34,51.53
N$8
  Top 0.254: R12.1 C9.1 39.45,52.14 U8.30
N$9  (via drill 0.35)
  Top 0.254: R13.2 23.31,46.99 R12.2 37.59,47.06 v37.59,46.99 | v41.02,46.99 41.02,53.48 U8.29
  Bottom 0.254: v37.59,46.99 v41.02,46.99
N$10
  Top 0.254: R13.1 C21.1
N$11
  Top 0.254: U8.5 55.48,54.74
  Top 0.305: 55.48,54.74 L3.P$2
N$12  (via drill 0.35)
  Top 0.254: U8.7 v45.09,57.28 | v45.09,62.87 45.09,71.22 48.26,71.22 L4.P$2
  Bottom 0.254: v45.09,57.28 v45.09,62.87
N$13  (via drill 0.35)
  Top 0.254: C21.2 C11.1 32.66,42.42 | C20.2 14.45,61.33 | 32.66,42.42 32.66,41.4 53.16,41.4 53.16,43.99 55.45,43.99 55.45,48.76 57.66,48.76 v57.66,49.66 | L3.P$1 v57.66,58.17 | C18.1 v14.48,59.31 | v14.48,42.42 32.66,42.42 | AE1.1 v50.04,73.03
  Top 0.406: 14.45,61.33 C18.1
  Bottom 0.254: v57.66,49.66 v57.66,58.17 49.69,58.17 49.69,63.02 62.71,63.02 62.71,64.23 40.67,64.23 40.67,69.31 50.04,69.31 v50.04,73.03 | v14.48,59.31 v14.48,42.42
N$14
  Top 0.254: AE1.2 48.39,78.23 L4.P$1 46.48,78.11 46.48,71.63 44.68,71.63 44.68,69.44 37.92,69.44 37.92,65.39 C17.2 27.69,65.41 16.49,65.41 C19.2 16.51,67.06 16.51,68.14 13.73,68.14 11.18,65.58 C20.1
N$18
  Top 0.254: R18.1 R17.1 R16.2 11.56,40.77 C13.2
  Top 0.406: C13.2 11.5,35.81 U5.5
N$25  (via drill 0.35)
  Top 0.254: R19.2 58.29,46.1 v60.58,46.1 | v20.32,37.08 20.32,35.81 U5.1
  Bottom 0.254: v60.58,46.1 60.58,42.29 58.29,42.29 58.29,37.08 v20.32,37.08
N$26
  Top 0.254: R17.2 R18.2 2.16,47.3 2.16,43.94 5.97,43.94 R20.1
N$27  (via drill 0.35)
  Top 0.254: U6.9 9.8,14.71 9.8,10.19 10.69,10.19 10.69,7.21 v14.48,7.21 | v25.02,4.06 DMG1.G
  Bottom 0.254: v14.48,7.21 14.48,4.06 v25.02,4.06
N$28  (via drill 0.35)
  Top 0.254: U6.7 20.07,13.71 v20.07,7.24 | v33.02,6.86 DMG2.G
  Bottom 0.254: v20.07,7.24 33.02,7.24 v33.02,6.86
N$29  (via drill 0.35)
  Top 0.254: U6.3 7.64,14.22 5.97,14.22 v5.97,14.86 | v11.43,17.91 R6.1
  Bottom 0.254: v11.43,17.91 11.43,16.26 5.97,16.26 v5.97,14.86
N$30
  Top 0.254: R4.2 10.03,6.06 9.23,6.86 C4.2
N$31
  Top 0.254: C3.1 6.86,6.06 7.53,6.73 C4.1 5.97,8.38 5.97,13.71 U6.4
N$33  (via drill 0.35)
  Top 0.254: U6.5 v8.76,13.21 | R8.2 55.63,13.65 v55.63,11.68 60.01,11.68 R7.1
  Bottom 0.254: v8.76,13.21 51.94,13.21 51.94,11.68 v55.63,11.68
N$34
  Top 0.254: R8.1 53.66,8.13 R10.P$1
N$35
  Top 0.254: U7.3 45.09,19.57
  Top 0.305: 45.09,19.57 CSP1.1
N$36
  Top 0.254: BSH.G 32.43,20.32 U7.5
N$37
  Top 0.254: RZ1.1 CZ1.1
N$38
  Top 0.254: RZ1.2 38.43,14.99 U7.1
N$39  (via drill 0.35)
  Top 0.254: U7.2 38.44,18.8 48.9,18.8 | 48.9,18.8 CFB1.2 | v55.12,30.35 RFB4.2 | v52.32,20.7 48.96,20.7 RFB3.1 48.9,18.8
  Bottom 0.305: v55.12,30.35 55.12,27.43 52.32,27.43 v52.32,20.7
N$40
  Top 0.254: ROSC1.2 32.43,18.8 U7.7
N$41
  Top 0.254: U7.8 32.43,14.86 RDUTY1.2
N$42
  Top 0.254: RFB4.1 42.67,30.35 R9.P$1
N$43
  Top 0.254: BSH.D 27.81,21.27 D4.P$2 38.48,25.35
  Top 0.305: 38.48,25.35 L1.P$2
NRD  (via drill 0.35)
  Top 0.254: U1.14 v72.39,61.85 | v67.06,61.09 64.39,61.09 64.01,61.09 55.5,61.09 55.5,62.36 48.25,62.36 U8.11
  Bottom 0.254: v72.39,61.85 71.63,61.09 v67.06,61.09
NWR  (via drill 0.35)
  Top 0.254: U1.13 v72.39,63.12 | v67.06,62.36 65.53,62.36 64.01,62.36 v62.1,62.36 | U8.10 v50.29,61.09
  Bottom 0.254: v72.39,63.12 71.63,62.36 v67.06,62.36 | v50.29,61.09 55.5,61.09 55.5,62.36 v62.1,62.36
R0  (via drill 0.35)
  Top 0.254: X1.5 93.25,29.56 93.85,28.96 93.85,26.42 91.44,24 v89.15,24 | v75.44,23.88 74.68,23.11 U4.P$3
  Bottom 0.254: v89.15,24 75.56,24 v75.44,23.88
R1
  Top 0.254: X1.6 87.46,30.06 84.33,26.92 84.33,20.83 83.31,19.81 76.96,19.81 75.95,20.83 U4.P$4
R2  (via drill 0.35)
  Top 0.254: X1.7 93.52,30.56 94.31,29.77 94.31,26.23 91,22.91 v89.15,22.91 | v82.1,22.91 80.72,22.91 80.39,23.24 77.72,23.24 77.22,22.73 U4.P$5
  Bottom 0.254: v89.15,22.91 v82.1,22.91
R3
  Top 0.254: U4.P$6 78.49,20.83 79.04,20.27 83.06,20.27 83.87,21.08 83.87,27.23 87.7,31.06 X1.8
R4  (via drill 0.35)
  Top 0.254: X1.9 93.79,31.56 94.77,30.58 94.77,26.04 90.94,22.2 88.86,22.2 87.88,23.18 87.88,25.27 v87.12,26.04 | v80.52,25.91 79.63,25.02 78.36,25.02 77.22,26.16 U4.P$10
  Bottom 0.254: v87.12,26.04 80.64,26.04 v80.52,25.91
R5
  Top 0.254: X1.10 87.81,32.06 83.41,27.66 83.41,24.89 82.9,24.38 77.09,24.38 75.95,25.53 U4.P$11
R6  (via drill 0.35)
  Top 0.254: X1.11 93.93,32.56 94.81,31.69 94.93,31.56 95.23,31.26 95.23,25.85 91.13,21.75 88.54,21.75 87.42,22.86 87.42,24.72 v87.12,25.02 | v74.89,24.69 74.68,24.91 U4.P$12
  Bottom 0.254: v87.12,25.02 86.79,24.69 v74.89,24.69
R7
  Top 0.254: X1.12 87.8,33.06 83.31,28.57 73.91,28.57 73.41,28.07 U4.P$13
R_IN
  Top 0.254: U1.6 72.8,72.01 68.83,68.05 68.83,25.4 U4.P$1 U4.P$2
RESET  (via drill 0.35)
  Top 0.254: v72.14,75.82 U1.3 | U4.P$9 v78.49,25.91 | U2.P$9 v78.49,35.43 | U3.P$9 v78.49,44.83 | C1.1 70.3,12.2 R3.2 69.28,13.65 v68.58,14.35
  Bottom 0.254: 63.12,25.4 63.12,34.67 | 63.12,34.67 63.12,44.07 | 63.12,44.07 63.12,70.61 68.33,75.82 v72.14,75.82 | v78.49,25.91 77.98,25.4 63.12,25.4 | v78.49,35.43 77.72,34.67 63.12,34.67 | v78.49,44.83 77.72,44.07 63.12,44.07 | v68.58,14.35 66.17,14.35 62.36,18.16 62.36,24.64 63.12,25.4
V_BAT
  Bottom 0.813: X2.P$1 60.58,32.13 JP5.2
V_CHARGE  (via drill 0.35)
  Top 0.813: L2.P$2 C7.P$1 51.51,9.27 51.51,6.97 60.45,6.97 R7.2 60.45,9.27 62.1,9.27 62.1,12.83 v60.58,12.83
  Bottom 0.813: v60.58,12.83 JP5.1
V_IN  (via drill 0.35)
  Top 0.813: U7.4 38.48,20.37 L1.P$1 v32.51,21.97 | 32.51,38.6 v32.51,30.23 | 32.51,38.6 C5.1 55.75,38.67 58.29,38.67 | 58.29,38.67 C_IN1.1 JP5.3 | R19.1 58.29,38.67 | U5.2 16.69,38.6 32.51,38.6
  Bottom 0.813: v32.51,21.97 v32.51,30.23
V_USB
  Top 0.406: U6.1 8.6,15.21 8.89,15.49
  Top 0.813: DMG1.D 28.58,5.59 25.52,5.59 25.52,16.2 8.76,16.2 | C16.1 JP4.1 7.69,17.65 R6.2 7.69,16.2 8.76,16.2 | 8.76,16.2 8.89,16.08 8.89,15.49
VCC  (via drill 0.35)
  Top 0.508: 77.09,10.79 S2.P$6 S2.P$3 | 77.09,10.79 75.06,8.76 75.06,6.86 | U1.2 71.79,77.09 68.07,73.37 68.07,51.18 64.96,48.07 64.26,47.37 v64.26,46.23 v64.26,36.83 v64.26,27.43 v64.26,19.94 64.26,11.43 68.83,6.86 75.06,6.86 | JP1.1 75.06,6.86 | U2.P$14 72.1,36.83 v71.25,36.83 | U3.P$14 71.28,46.19 v71.25,46.23 | U4.P$14 71.28,27.4 v71.25,27.43 | v84.96,20.19 84.96,26.54 87.48,29.06 X1.4 90.4,29.06 90.93,29.59 90.93,41.91 91.58,42.56 X1.31 | R1.2 77.34,11.05 77.09,10.79
  Top 0.813: C13.1 13.4,35.81 U5.4 13.29,33.66 4.57,33.66 R20.2 | 64.96,48.07 56.13,48.07 56.13,43.31 53.85,43.31 53.85,40.71 C6.P$2 17.91,40.77 C13.1 | C13.1 C22.1 13.4,57.53 22.23,57.53 22.23,58.61 23.41,58.61 | 23.41,58.61 C2.1+ 23.41,61.09 v25.65,61.09 | 23.41,58.61 C12.1 | U8.22 U8.23 | v41.27,58.55 39.46,58.55 U8.25 U8.26 44.2,57.28 44.2,56.01 48.25,56.01 U8.6 | v41.27,61.09 U8.23 | v36.96,61.09 U8.23
  Bottom 0.508: v71.25,36.83 v64.26,36.83 | v71.25,46.23 v64.26,46.23 | v71.25,27.43 v64.26,27.43 | v84.96,20.19 84.71,19.94 v64.26,19.94
  Bottom 0.813: v41.27,58.55 v41.27,61.09 | v25.65,61.09 v36.96,61.09
VDD  (via drill 0.35)
  Top 0.508: X1.1 91.82,27.05 86.74,27.05 85.98,26.29 v85.98,20.19
  Top 0.813: D4.P$1 48.9,28.45 | 48.9,28.45 RFB3.2 | 48.9,28.45 57.85,28.45 C_OUT1.1 57.91,21.84 57.91,18.8 CFB1.1 v63.25,18.8
  Bottom 0.508: v85.98,20.19 85.98,19.3 85.47,18.8 v63.25,18.8
VSYNC  (via drill 0.35)
  Top 0.254: U1.10 78.11,66.93 79.76,65.28 79.76,58.8 v82.04,56.52 | X1.33 91.44,43.56 90.21,44.79 90.21,47.37 89.2,48.39 v86.49,48.39
  Bottom 0.254: v82.04,56.52 86.49,52.07 v86.49,48.39

### Text on the board
tNames: ECE 445 Senior Design Project Lab / Odds Booster / Team 37 | C2 | X3